# Altium schematic sheet 0030_DEBUG_CARD_SPI_SIG.SchDoc
size A3
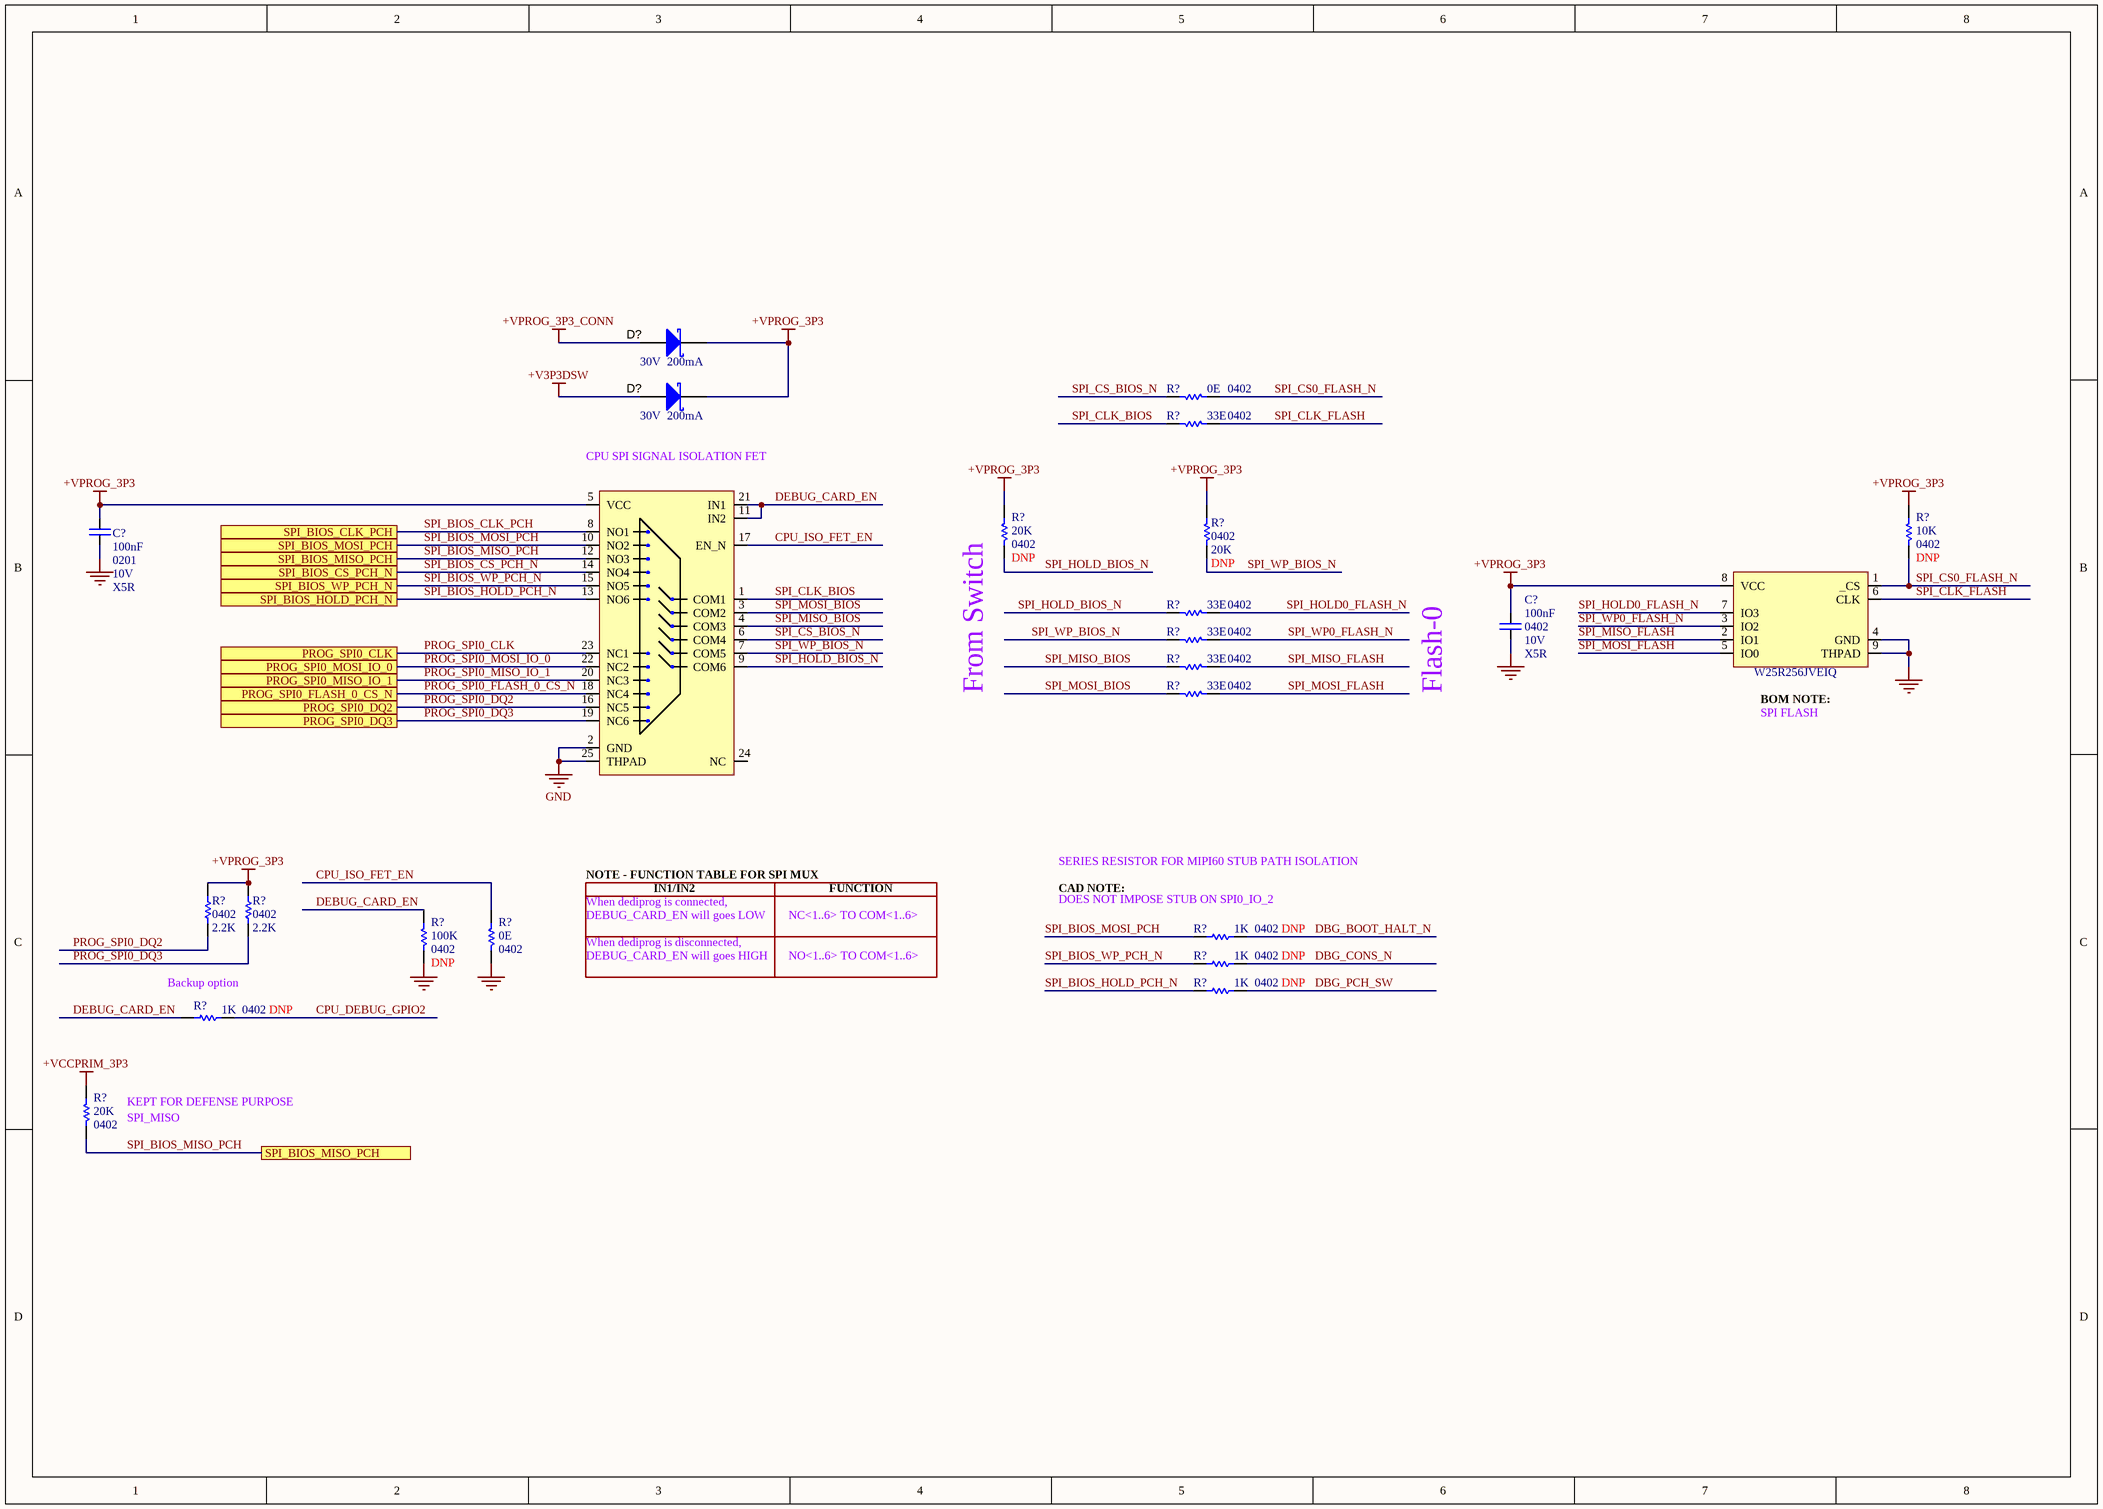
[diagram p0: 0030_DEBUG_CARD_SPI_SIG.SchDoc]

## Parts
(Parts that share a designator on the sheet are numbered #1, #2 ... from top to bottom, then left to right.)
C?#1  value 100nF  Case/Package: 0201  Voltage: 10V  Dielectric: X5R  [CAPC0201]
C?#2  value 100nF  Case/Package: 0402  Voltage: 10V  Dielectric: X5R  [CAPC0402]
D?#1  Current: 200mA  Voltage: 30V  (hidden comment: SCHOTTKY)
D?#2  Current: 200mA  Voltage: 30V  (hidden comment: SCHOTTKY)
EU?#1  C_TS3A27518E  (value not drawn)
EU?#2  Manufacturer Part Number: W25R256JVEIQ  (hidden comment: W25R256JV)
R?#1  value 0E  Case/Package: 0402  [RESC0402]  (hidden comment: Res)
R?#2  value 33E  Case/Package: 0402  [RESC0402]  (hidden comment: Res)
R?#3  value 20K  Case/Package: 0402  [RESC0402]  (hidden comment: Res)
R?#4  value 20K  Case/Package: 0402  [RESC0402]  (hidden comment: Res)
R?#5  value 10K  Case/Package: 0402  [RESC0402]  (hidden comment: Res)
R?#6  value 33E  Case/Package: 0402  [RESC0402]  (hidden comment: Res)
R?#7  value 33E  Case/Package: 0402  [RESC0402]  (hidden comment: Res)
R?#8  value 33E  Case/Package: 0402  [RESC0402]  (hidden comment: Res)
R?#9  value 33E  Case/Package: 0402  [RESC0402]  (hidden comment: Res)
R?#10  value 2.2K  Case/Package: 0402  [RESC0402]  (hidden comment: Res)
R?#11  value 2.2K  Case/Package: 0402  [RESC0402]  (hidden comment: Res)
R?#12  value 100K  Case/Package: 0402  [RESC0402]  (hidden comment: Res)
R?#13  value 0E  Case/Package: 0402  [RESC0402]  (hidden comment: Res)
R?#14  value 1K  Case/Package: 0402  [RESC0402]  (hidden comment: Res)
R?#15  value 1K  Case/Package: 0402  [RESC0402]  (hidden comment: Res)
R?#16  value 1K  Case/Package: 0402  [RESC0402]  (hidden comment: Res)
R?#17  value 1K  Case/Package: 0402  [RESC0402]  (hidden comment: Res)
R?#18  value 20K  Case/Package: 0402  [RESC0402]  (hidden comment: Res)

## Ports
PROG_SPI0_CLK, PROG_SPI0_DQ2, PROG_SPI0_DQ3, PROG_SPI0_FLASH_0_CS_N, PROG_SPI0_MISO_IO_1, PROG_SPI0_MOSI_IO_0, SPI_BIOS_CLK_PCH, SPI_BIOS_CS_PCH_N, SPI_BIOS_HOLD_PCH_N, SPI_BIOS_MISO_PCH, SPI_BIOS_MOSI_PCH, SPI_BIOS_WP_PCH_N

## Nets
+V3P3DSW: D?#2.A
+VCCPRIM_3P3: R?#18.2
+VPROG_3P3: C?#1.1 C?#2.1 D?#1.K D?#2.K EU?#1.5(VCC) EU?#2.8(VCC) R?#3.2 R?#4.2 R?#5.2 R?#10.2 R?#11.2
+VPROG_3P3_CONN: D?#1.A
GND: C?#1.2 C?#2.2 EU?#1.2(GND) EU?#1.25(THPAD) EU?#2.4(GND) EU?#2.9(THPAD) R?#12.1 R?#13.1
CPU_DEBUG_GPIO2: R?#17.1
CPU_ISO_FET_EN: EU?#1.17(EN_N) R?#13.2
DBG_BOOT_HALT_N: R?#14.1
DBG_CONS_N: R?#15.1
DBG_PCH_SW: R?#16.1
DEBUG_CARD_EN: EU?#1.11(IN2) EU?#1.21(IN1) R?#12.2 R?#17.2
PROG_SPI0_CLK: EU?#1.23(NC1) ; port PROG_SPI0_CLK
PROG_SPI0_DQ2: EU?#1.16(NC5) R?#10.1 ; port PROG_SPI0_DQ2
PROG_SPI0_DQ3: EU?#1.19(NC6) R?#11.1 ; port PROG_SPI0_DQ3
PROG_SPI0_FLASH_0_CS_N: EU?#1.18(NC4) ; port PROG_SPI0_FLASH_0_CS_N
PROG_SPI0_MISO_IO_1: EU?#1.20(NC3) ; port PROG_SPI0_MISO_IO_1
PROG_SPI0_MOSI_IO_0: EU?#1.22(NC2) ; port PROG_SPI0_MOSI_IO_0
SPI_BIOS_CLK_PCH: EU?#1.8(NO1) ; port SPI_BIOS_CLK_PCH
SPI_BIOS_CS_PCH_N: EU?#1.14(NO4) ; port SPI_BIOS_CS_PCH_N
SPI_BIOS_HOLD_PCH_N: EU?#1.13(NO6) R?#16.2 ; port SPI_BIOS_HOLD_PCH_N
SPI_BIOS_MISO_PCH: EU?#1.12(NO3) R?#18.1 ; port SPI_BIOS_MISO_PCH
SPI_BIOS_MOSI_PCH: EU?#1.10(NO2) R?#14.2 ; port SPI_BIOS_MOSI_PCH
SPI_BIOS_WP_PCH_N: EU?#1.15(NO5) R?#15.2 ; port SPI_BIOS_WP_PCH_N
SPI_CLK_BIOS: EU?#1.1(COM1) R?#2.1
SPI_CLK_FLASH: EU?#2.6(CLK) R?#2.2
SPI_CS0_FLASH_N: EU?#2.1(_CS) R?#1.2 R?#5.1
SPI_CS_BIOS_N: EU?#1.6(COM4) R?#1.1
SPI_HOLD0_FLASH_N: EU?#2.7(IO3) R?#6.2
SPI_HOLD_BIOS_N: EU?#1.9(COM6) R?#3.1 R?#6.1
SPI_MISO_BIOS: EU?#1.4(COM3) R?#8.1
SPI_MISO_FLASH: EU?#2.2(IO1) R?#8.2
SPI_MOSI_BIOS: EU?#1.3(COM2) R?#9.1
SPI_MOSI_FLASH: EU?#2.5(IO0) R?#9.2
SPI_WP0_FLASH_N: EU?#2.3(IO2) R?#7.2
SPI_WP_BIOS_N: EU?#1.7(COM5) R?#4.1 R?#7.1

Not connected (* = marked no-connect by the designer): EU?#1 24(NC)

## Notes on the sheet
- CPU SPI SIGNAL ISOLATION FET
- (near R?#3) From Switch
- Flash-0
- (near EU?#2) BOM NOTE:
- SPI FLASH
- DEBUG_CARD_EN will goes LOW
- When dediprog is connected,
- NOTE - FUNCTION TABLE FOR SPI MUX
- IN1/IN2
- NC<1..6> TO COM<1..6>
- FUNCTION
- CAD NOTE:
- (near R?#14) DOES NOT IMPOSE STUB ON SPI0_IO_2
- SERIES RESISTOR FOR MIPI60 STUB PATH ISOLATION
- (near R?#17) Backup option
- DEBUG_CARD_EN will goes HIGH
- When dediprog is disconnected,
- NO<1..6> TO COM<1..6>
- (near R?#18) KEPT FOR DEFENSE PURPOSE
- (near R?#18) SPI_MISO

## Library data of the parts
C?#1 = Cap: CAP CER 100nF 10V X5R 0201
C?#2 = Cap: CAP CER 100nF 10V X5R 0402
D?#1 D?#2 = SCHOTTKY: Diode, Schottky, 30V, 200mA,; ComponentLink1Description: Datasheet link; ComponentLink1URL: http://www.comchip.com.tw/cms/UserFiles/QW-BB012%20CDBC520-G%7E5100-G%20RevC809622.pdf; Manufacturer Part Number: *; Case/Package: *
EU?#1 = C_TS3A27518E: 6 Circuit IC Switch 2:1 6.2Ohm 24-WQFN (4x4); Manufacturer Part Number: TS3A27518ERTWR; Case/Package: 24-WFQFN
EU?#2 = W25R256JV: FLASH - NOR Memory IC 256Mb (32M x 8) SPI - Quad I/O 133 MHz 7 ns 8-WSON (8x6); Case/Package: 8-WSON
R?#1 R?#13 = Res: Thick Film Resistor -  0ohm, 1%, 0402
R?#2 R?#6-R?#9 = Res: Thick Film Resistor -  33ohm, 1%, 0402
R?#3 R?#4 R?#18 = Res: Thick Film Resistor -  20Kohm, 1%, 0402
  R?#3 R?#4: DNP: DNP
R?#5 = Res: Thick Film Resistor -  10Kohm, 1%, 0402; DNP: DNP
R?#10 R?#11 = Res: Thick Film Resistor -  2.2Kohm, 1%, 0402
R?#12 = Res: Thick Film Resistor -  100Kohm, 1%, 0402; DNP: DNP
R?#14-R?#17 = Res: Thick Film Resistor -  1Kohm, 1%, 0402; DNP: DNP